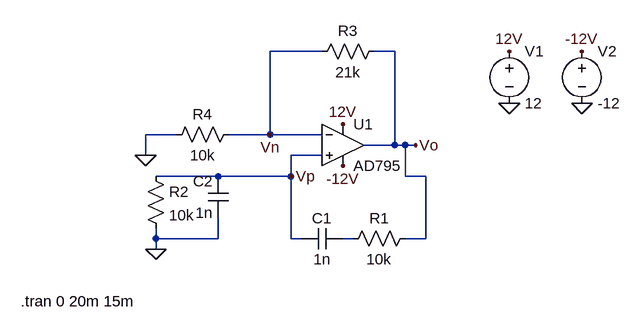
[diagram p0: schematic lab9.2.1.asc]
lab9.2.1.asc, the LTspice schematic file:
Version 4
SHEET 1 880 680
WIRE 128 16 48 16
WIRE 240 16 208 16
WIRE -96 144 -144 144
WIRE 48 144 48 16
WIRE 48 144 -16 144
WIRE 128 144 48 144
WIRE 240 160 240 16
WIRE 240 160 192 160
WIRE 256 160 240 160
WIRE 272 160 256 160
WIRE -144 176 -144 144
WIRE 128 176 80 176
WIRE -32 208 -128 208
WIRE 80 208 80 176
WIRE 80 208 -32 208
WIRE 256 208 256 160
WIRE 288 208 256 208
WIRE -128 304 -128 288
WIRE -32 304 -32 272
WIRE -32 304 -128 304
WIRE 80 304 80 208
WIRE 96 304 80 304
WIRE 176 304 160 304
WIRE 288 304 288 208
WIRE 288 304 256 304
WIRE -128 320 -128 304
FLAG 416 96 0
FLAG 528 96 0
FLAG 416 16 12V
FLAG 160 128 12V
FLAG 528 16 -12V
FLAG 160 192 -12V
FLAG -144 176 0
FLAG -128 320 0
FLAG 272 160 Vo
FLAG 48 144 Vn
FLAG 80 208 Vp
SYMBOL Opamps\\AD795 160 96 R0
SYMATTR InstName U1
SYMBOL voltage 416 0 R0
SYMATTR InstName V1
SYMATTR Value 12
SYMBOL voltage 528 0 R0
SYMATTR InstName V2
SYMATTR Value -12
SYMBOL res 272 288 R90
WINDOW 0 0 56 VBottom 2
WINDOW 3 32 56 VTop 2
SYMATTR InstName R1
SYMATTR Value 10k
SYMBOL cap 160 288 R90
WINDOW 0 0 32 VBottom 2
WINDOW 3 32 32 VTop 2
SYMATTR InstName C1
SYMATTR Value 1n
SYMBOL cap -16 272 R180
WINDOW 0 24 56 Left 2
WINDOW 3 24 8 Left 2
SYMATTR InstName C2
SYMATTR Value 1n
SYMBOL res -144 192 R0
SYMATTR InstName R2
SYMATTR Value 10k
SYMBOL res 224 0 R90
WINDOW 0 0 56 VBottom 2
WINDOW 3 32 56 VTop 2
SYMATTR InstName R3
SYMATTR Value 21k
SYMBOL res 0 128 R90
WINDOW 0 0 56 VBottom 2
WINDOW 3 32 56 VTop 2
SYMATTR InstName R4
SYMATTR Value 10k
TEXT -336 400 Left 2 !.tran 0 20m 15m

The netlist it stands for:
* lab9.2.1.asc
XU1 Vp Vn 12V -12V Vo AD795  ; pins In+ In- V+ V- OUT
V1 12V 0 12
V2 -12V 0 -12
R1 Vo N001 10k
C1 N001 Vp 1n
C2 0 Vp 1n
R2 Vp 0 10k
R3 Vo Vn 21k
R4 Vn 0 10k
.tran 0 20m 15m
.lib ADI1.lib
.backanno
.end